# EasyEDA Pro project ProPrj_4足轮足机器蜘蛛_2024-09-02.epro, board 驱动板
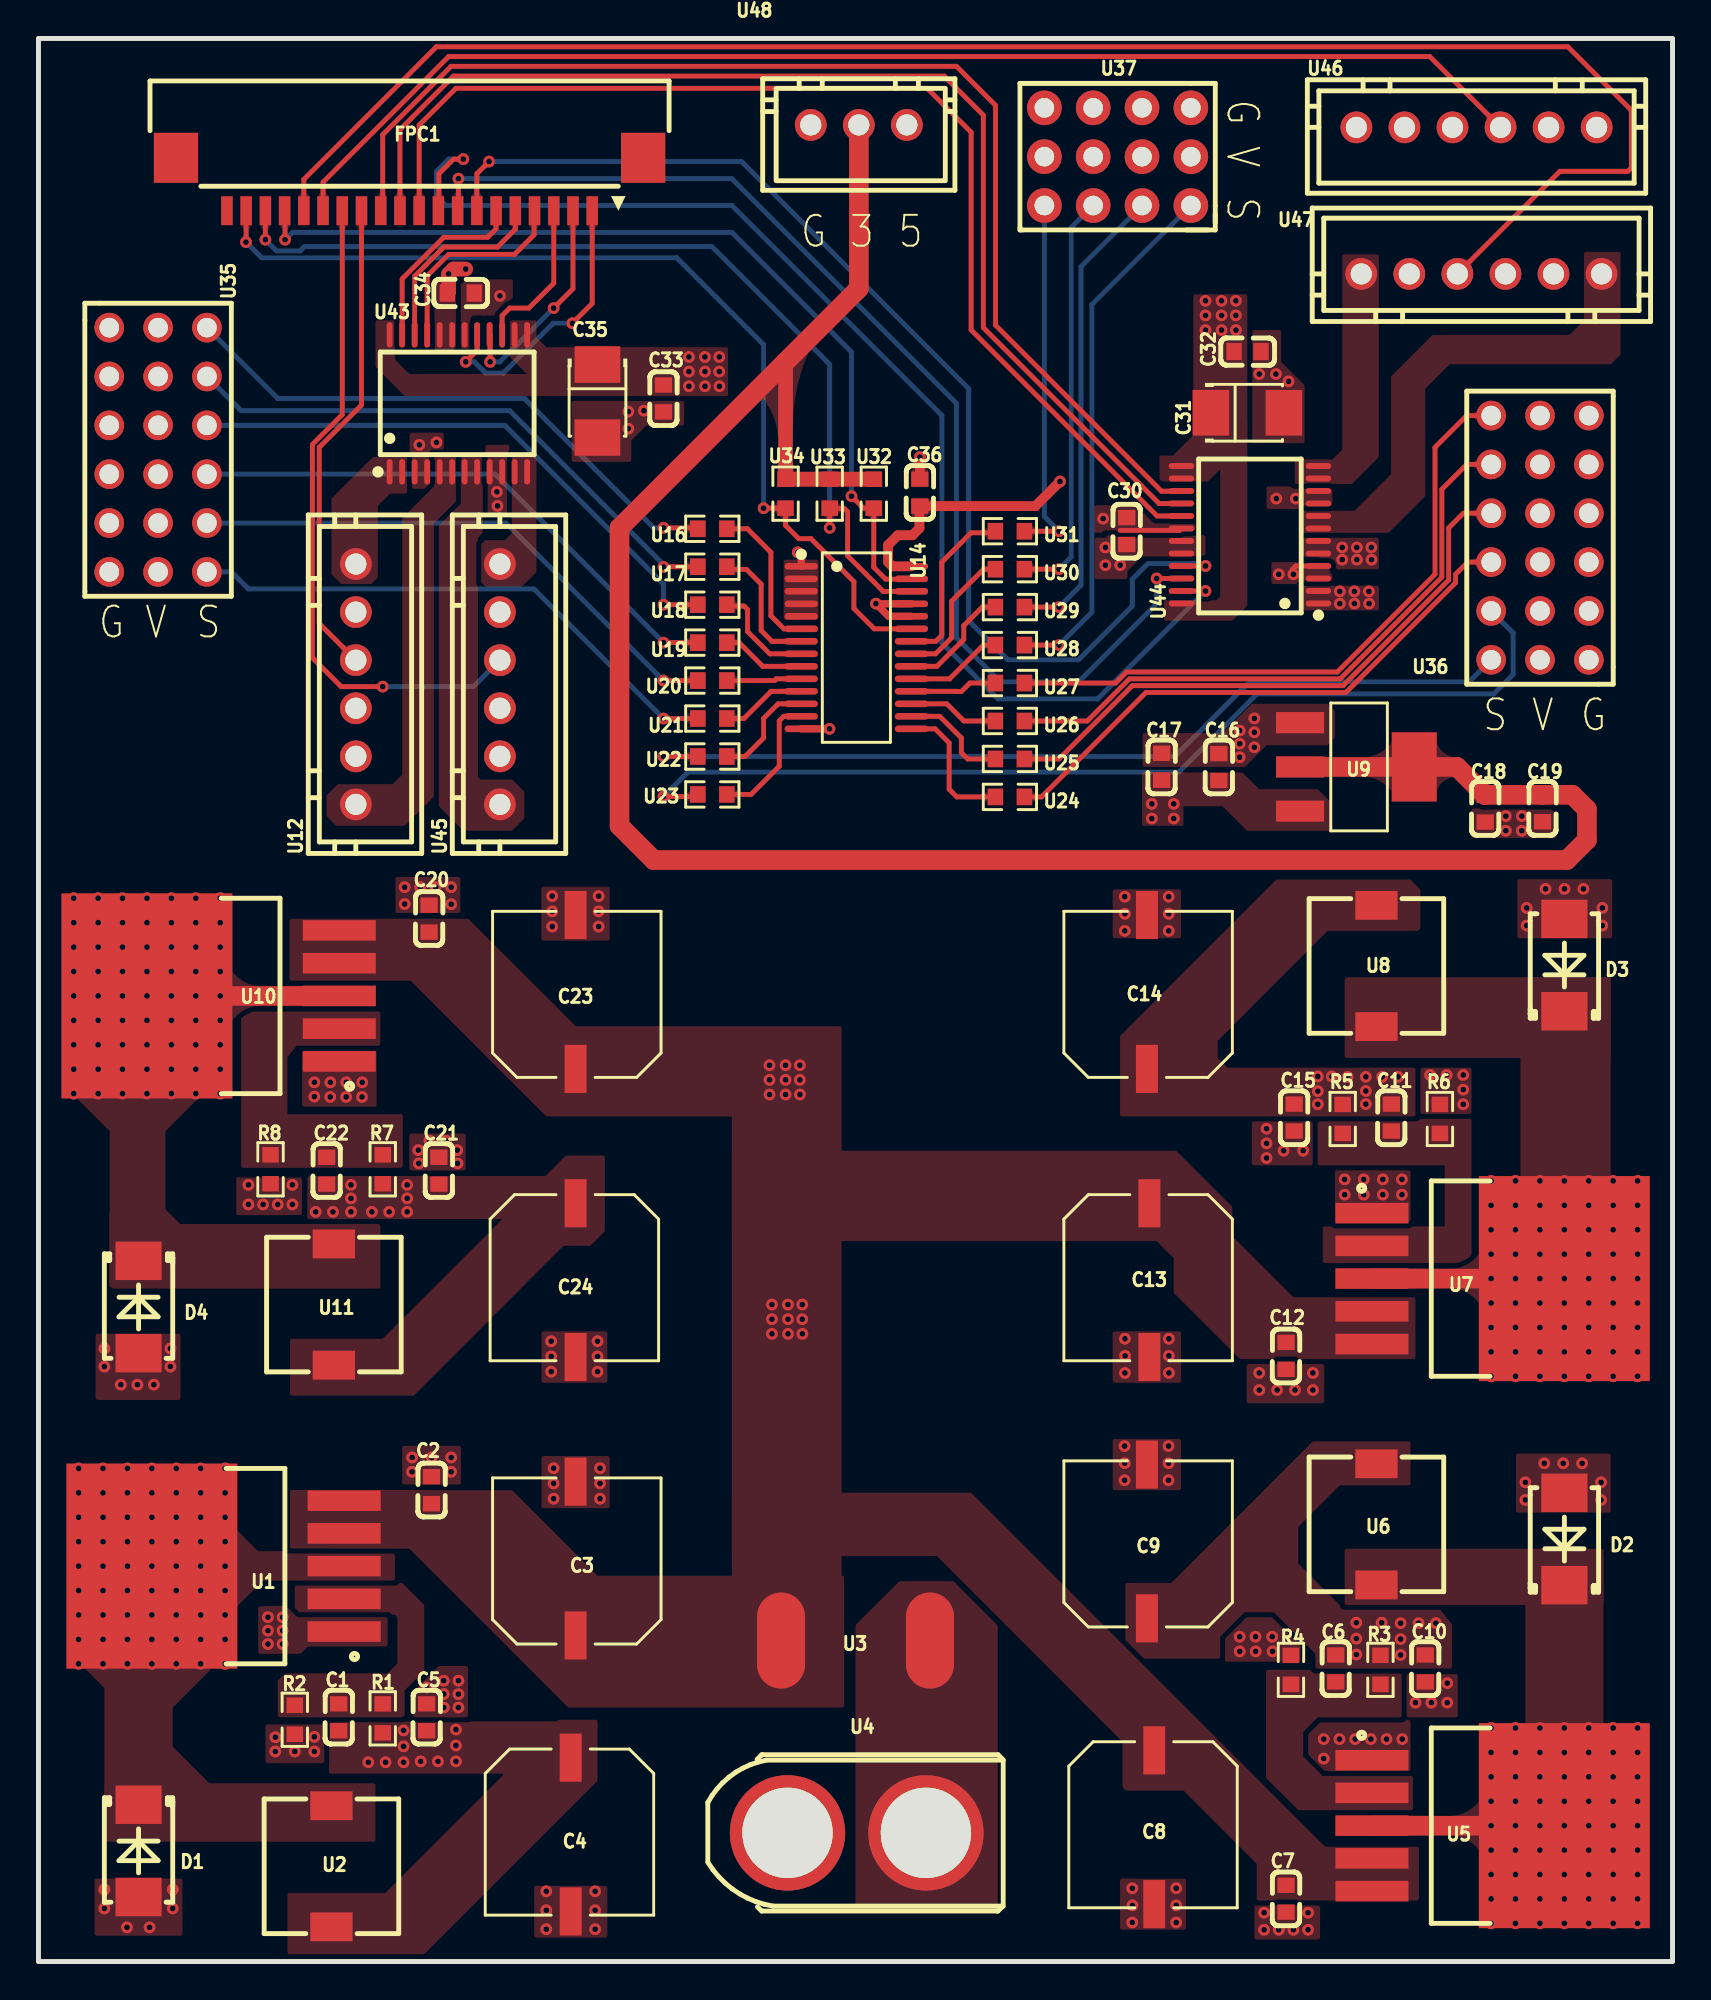
[diagram p2: board, top side]
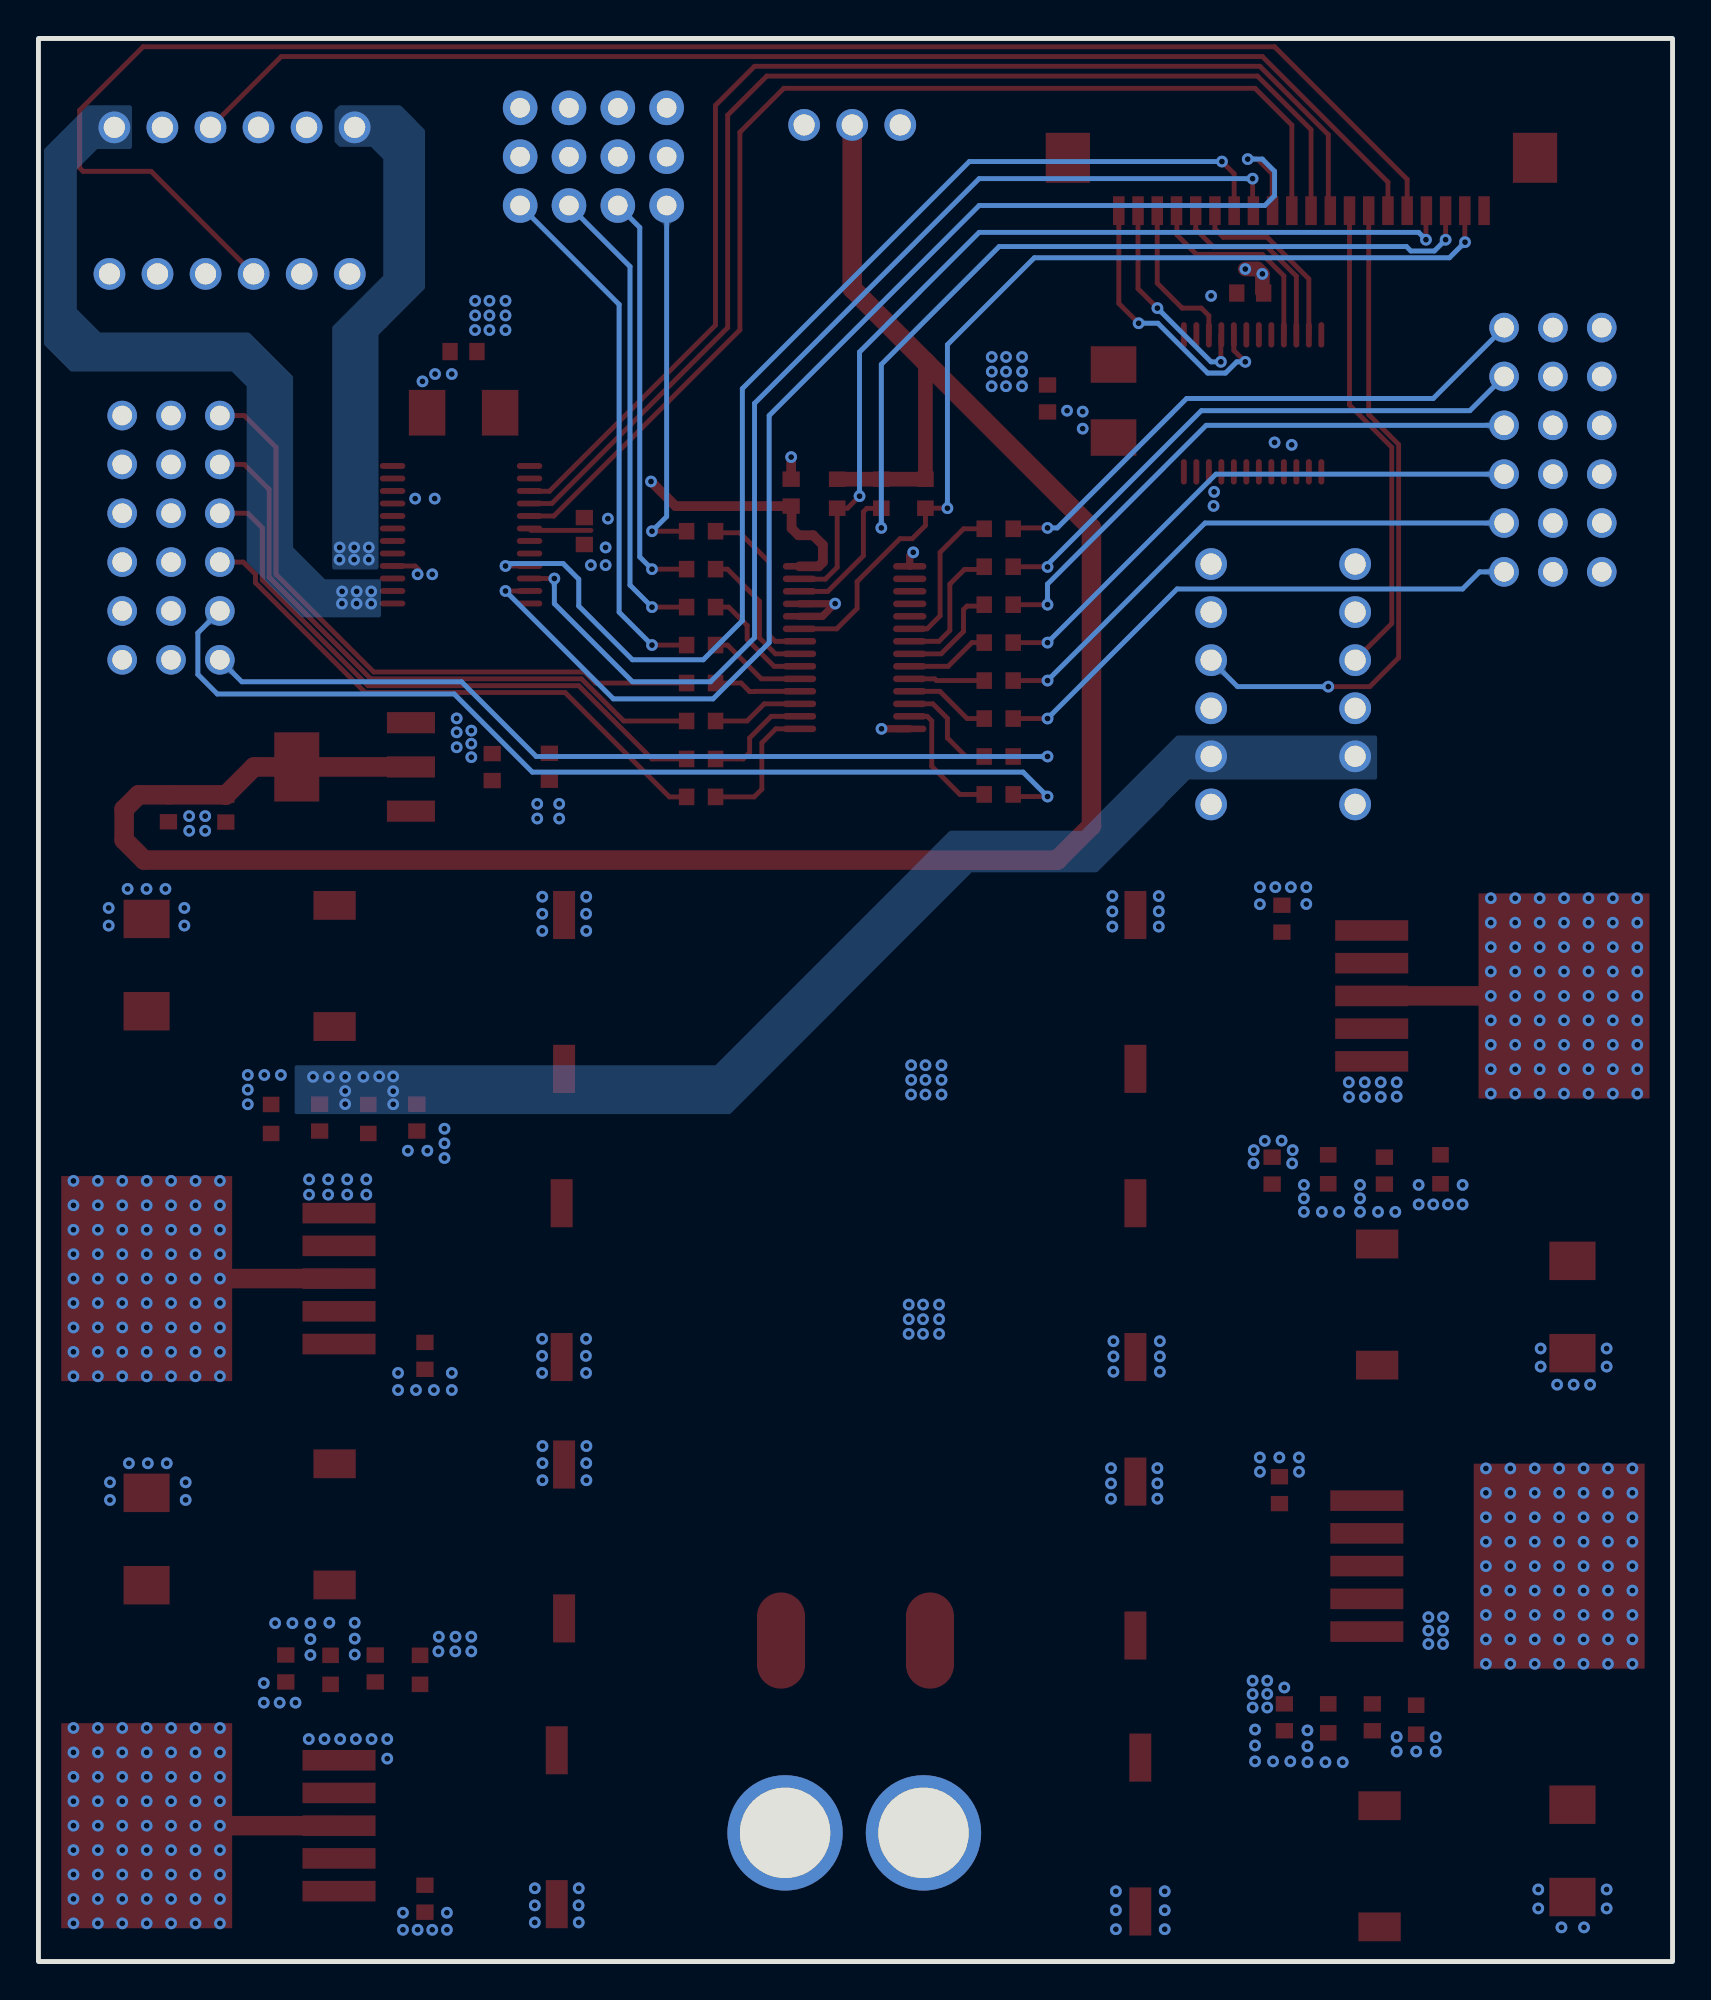
[diagram p3: board, bottom side, seen from below]

Outline 85 x 100 mm; copper layers: Top Layer, GND, VCC, Bottom Layer. Coordinates in mm from the lower left corner of the outline.
Outline path: rectangle 0,100 85,0
Stack: Top Layer 0.035mm 外层铜厚1oz / Dielectric1 0.2104mm 7628 RC49% 8.6mil / GND 0.0152mm 内层铜厚 / Dielectric2 1.065mm 1.1mm H/HOZ Copper / VCC 0.0152mm 内层铜厚 / Dielectric3 0.2104mm 7628 RC49% 8.6mil / Bottom Layer 0.035mm 外层铜厚1oz

## Design rules (mm)
template: 自定义配置
spacing copperThickness1oz (default): track to track 0.102, other pairs 0.152 to 0.3
spacing copperThickness2oz: track to track 0.203, other pairs 0.152 to 0.3
track width copperThickness1oz (default): min 0.127, default 0.254, max 12.7
track width copperThickness2oz: min 0.203, default 0.254, max 2.54
differential pair differentialPair (default): width min 0.127, default 0.254, max 2.54; gap min 0.152, default 0.152
via viaSize (default): diameter min 0.5, default 0.61, max 10; hole min 0.3, default 0.305, max 6.299

## Placement (name value [footprint] x y rotation side)
C1  33nF  [C0603]  15.62 12.7 270 top
C2  1uF  [C0603]  20.45 24.51 270 top
C3  贴片型铝电解电容  [SMD,8X10.5MM]  27.94 20.96 90 top
C4  贴片型铝电解电容  [SMD,8X10.5MM]  27.69 6.6 270 top
C5  1uF  [C0603]  20.19 12.7 270 top
C6  33nF  [C0603]  67.48 15.24 90 top
C7  1uF  [C0603]  64.9 3.27 90 top
C8  贴片型铝电解电容  [SMD,8X10.5MM]  58.04 6.99 270 top
C9  贴片型铝电解电容  [SMD,8X10.5MM]  57.66 21.84 90 top
C10  1uF  [C0603]  72.14 15.24 90 top
C11  33nF  [C0603]  70.37 43.89 90 top
C12  1uF  [C0603]  64.9 31.5 90 top
C13  贴片型铝电解电容  [SMD,8X10.5MM]  57.78 35.43 270 top
C14  贴片型铝电解电容  [SMD,8X10.5MM]  57.66 50.42 90 top
C15  1uF  [C0603]  65.32 43.89 90 top
C16  10uF  [C0603]  61.4 62.11 270 top
C17  100nF  [C0603]  58.43 62.13 90 top
C18  100nF  [C0603]  75.25 59.95 270 top
C19  10uF  [C0603]  78.24 59.97 90 top
C20  1uF  [C0603]  20.32 54.23 270 top
C21  1uF  [C0603]  20.83 41.13 270 top
C22  33nF  [C0603]  14.99 41.13 270 top
C23  贴片型铝电解电容  [SMD,8X10.5MM]  27.94 50.42 90 top
C24  贴片型铝电解电容  [SMD,8X10.5MM]  27.94 35.43 270 top
C30  100nF  [C0603]  56.61 74.39 90 top
C31  10uF  [CAP-SMD_L3.5-W2.8-R-RD]  62.88 80.54 180 top
C32  100nF  [C0603]  62.89 83.72 180 top
C33  100nF  [C0603]  32.51 81.28 90 top
C34  100nF  [C0603]  21.97 86.76 0 top
C35  10uF  [CAP-SMD_L3.5-W2.8-R-RD]  29.08 81.15 90 top
C36  100nF  [C0603]  45.85 76.38 270 top
D1  SS1045-SMB  [SMB_L4.4-W3.6-LS5.3-RD]  5.21 5.75 270 top
D2  SS1045-SMB  [SMB_L4.4-W3.6-LS5.3-RD]  79.38 21.97 90 top
D3  SS1045-SMB  [SMB_L4.4-W3.6-LS5.3-RD]  79.38 51.82 90 top
D4  SS1045-SMB  [SMB_L4.4-W3.6-LS5.3-RD]  5.21 34.04 270 top
FPC1  1.0K-FX-20PWBG  [FPC-SMD_20P-P1.00-HDGE_1.0K-FX-20PWBG]  19.3 92.42 180 top
R1  21kΩ  [R0603]  17.91 12.64 270 top
R2  3kΩ  [R0603]  13.33 12.57 90 top
R3  21kΩ  [R0603]  69.81 15.17 90 top
R4  3kΩ  [R0603]  65.15 15.17 270 top
R5  16kΩ  [R0603]  67.84 43.81 90 top
R6  3kΩ  [R0603]  72.9 43.81 270 top
R7  21kΩ  [R0603]  17.91 41.2 270 top
R8  3kΩ  [R0603]  12.07 41.2 90 top
U1  XL4005E1  [TO-263-5_L10.2-W9.2-P1.70-TL]  10.9 20.56 180 top
U2  33uH/5A  [IND-SMD_L7.0-W7.0_SLF7055T]  15.24 4.95 90 top
U3  船型开关接口  [两个焊盘]  38.63 16.69 270 top
U4  XT60UPB-F  [CONN-TH_XT60UPB-F]  42.56 6.69 0 top
U5  XL4005E1  [TO-263-5_L10.2-W9.2-P1.70-TL]  74.37 7.06 0 top
U6  33uH/5A  [IND-SMD_L7.0-W7.0_SLF7055T]  69.6 22.73 270 top
U7  XL4005E1  [TO-263-5_L10.2-W9.2-P1.70-TL]  74.37 35.51 0 top
U8  33uH/5A  [IND-SMD_L7.0-W7.0_SLF7055T]  69.6 51.77 270 top
U9  AMS1117-3.3  [SOT-223-3_L6.5-W3.4-P2.30-LS7.0-BR]  68.59 62.12 180 top
U10  XL4005E1  [TO-263-5_L10.2-W9.2-P1.70-TL]  10.65 50.21 180 top
U11  33uH/5A  [IND-SMD_L7.0-W7.0_SLF7055T]  15.37 34.16 90 top
U12  XH2.54-6P  [CONN-TH_XH2.54-6P]  16.51 66.42 90 top
U14  PCA9685PW  [TSSOP-28_L9.7-W4.4-P0.65-LS6.4-BL]  42.54 68.33 270 top
U16  220Ω  [R0603]  35.05 74.5 0 top
U17  220Ω  [R0603]  35.05 72.53 0 top
U18  220Ω  [R0603]  35.05 70.56 0 top
U19  220Ω  [R0603]  35.05 68.58 0 top
U20  220Ω  [R0603]  35.05 66.61 0 top
U21  220Ω  [R0603]  35.05 64.64 0 top
U22  220Ω  [R0603]  35.05 62.66 0 top
U23  220Ω  [R0603]  35.05 60.69 0 top
U24  220Ω  [R0603]  50.53 60.56 0 top
U25  220Ω  [R0603]  50.53 62.53 0 top
U26  220Ω  [R0603]  50.53 64.51 0 top
U27  220Ω  [R0603]  50.53 66.48 0 top
U28  220Ω  [R0603]  50.53 68.46 0 top
U29  220Ω  [R0603]  50.53 70.43 0 top
U30  220Ω  [R0603]  50.53 72.4 0 top
U31  220Ω  [R0603]  50.53 74.38 0 top
U32  4.7kΩ  [R0603]  43.45 76.33 90 top
U33  4.7kΩ  [R0603]  41.16 76.33 90 top
U34  4.7kΩ  [R0603]  38.86 76.33 90 top
U35  -  [HX2.54MM-3X6PIN]  3.68 84.96 270 top
U36  -  [HX2.54MM-3X6PIN]  80.65 67.69 90 top
U37  -  [XH2.54MM-3X4P]  59.94 96.39 180 top
U43  TB6612FNG,C,8,EL  [SSOP-24_L8.3-W5.6-P0.65-LS7.6-BL]  21.84 81.03 0 top
U44  TB6612FNG,C,8,EL  [SSOP-24_L8.3-W5.6-P0.65-LS7.6-BL]  63.02 74.19 90 top
U45  XH2.54-6P  [CONN-TH_XH2.54-6P]  24 66.42 90 top
U46  XH2.54-6P  [CONN-TH_XH2.54-6P]  74.8 95.38 0 top
U47  XH2.54-6P  [CONN-TH_XH2.54-6P]  75.06 87.76 180 top
U48  XH2.54-3P 直插  [CONN-TH_XH2.54-3P]  42.67 95.5 0 top

## Footprints (pads in the part's own frame, mm; a bottom-side part is the same pattern mirrored in y, then rotated)
C0603
  rect 0.8x0.9 smd: 1(-0.7,0) 2(0.7,0)
CAP-SMD_L3.5-W2.8-R-RD
  rect 1.9x2.376 smd: 1(1.899,0) 2(-1.899,0)
CONN-TH_XH2.54-3P
  round 1.65 hole 1.1: 1(-2.5,0) 2(0,0) 3(2.5,0)
CONN-TH_XH2.54-6P
  round 1.65 hole 1.1: 1(-6.25,0) 2(-3.75,0) 3(-1.25,0) 4(1.25,0) 5(3.75,0) 6(6.25,0)
CONN-TH_XT60UPB-F
  round 6 hole 4.7: 1(3.6,0) 2(-3.6,0)
FPC-SMD_20P-P1.00-HDGE_1.0K-FX-20PWBG
  rect 0.6x1.5 smd: 1(-9.5,1.375) 2(-8.5,1.375) 3(-7.5,1.375) 4(-6.5,1.375) 5(-5.5,1.375) 6(-4.5,1.375) 7(-3.5,1.375) 8(-2.5,1.375) 9(-1.5,1.375) 10(-0.5,1.375) 11(0.5,1.375) 12(1.5,1.375) 13(2.5,1.375) 14(3.5,1.375) 15(4.5,1.375) 16(5.5,1.375) 17(6.5,1.375) 18(7.5,1.375) 19(8.5,1.375) 20(9.5,1.375)
  rect 2.3x2.6 smd: 21(12.15,-1.375) 22(-12.15,-1.375)
HX2.54MM-3X6PIN
  round 1.54 hole 1.02: 1(0,0) 2(2.54,0) 3(5.08,0) 4(7.62,0) 5(10.16,0) 6(12.7,0) 7(0,2.54) 8(2.54,2.54) 9(5.08,2.54) 10(7.62,2.54) 11(10.16,2.54) 12(12.7,2.54) 13(0,5.08) 14(2.54,5.08) 15(5.08,5.08) 16(7.62,5.08) 17(10.16,5.08) 18(12.7,5.08)
IND-SMD_L7.0-W7.0_SLF7055T
  rect 1.5x2.2 smd: 1(-3.15,0) 2(3.15,0)
R0603
  rect 0.806x0.864 smd: 1(-0.753,0) 2(0.753,0)
SMB_L4.4-W3.6-LS5.3-RD
  rect 2x2.4 smd: 1(-2.4,0) 2(2.4,0)
SMD,8X10.5MM
  rect 2.5x1.143 smd: 1(-4,0) 2(4,0)
SOT-223-3_L6.5-W3.4-P2.30-LS7.0-BR
  rect 2.5x1.1 smd: 1(2.97,-2.3) 2(2.97,0) 3(2.97,2.3)
  rect 2.34x3.6 smd: 4(-2.97,0)
SSOP-24_L8.3-W5.6-P0.65-LS7.6-BL
  oval 0.308x1.324 smd: 1(-3.575,-3.562) 2(-2.925,-3.562) 3(-2.275,-3.562) 4(-1.625,-3.562) 5(-0.975,-3.562) 6(-0.325,-3.562) 7(0.325,-3.562) 8(0.975,-3.562) 9(1.625,-3.562) 10(2.275,-3.562) 11(2.925,-3.562) 12(3.575,-3.562) 13(3.575,3.562) 14(2.925,3.562) 15(2.275,3.562) 16(1.625,3.562) 17(0.975,3.562) 18(0.325,3.562) 19(-0.325,3.562) 20(-0.975,3.562) 21(-1.625,3.562) 22(-2.275,3.562) 23(-2.925,3.562) 24(-3.575,3.562)
TO-263-5_L10.2-W9.2-P1.70-TL
  rect 3.8x1.069 smd: 1(-5.003,3.404) 2(-5.003,1.702) 3(-5.003,0) 4(-5.003,-1.702) 5(-5.003,-3.404)
  rect 8.89x10.66 smd: 6(5.003,0)
TSSOP-28_L9.7-W4.4-P0.65-LS6.4-BL
  oval 0.343x1.732 smd: 1(-4.225,-2.866) 2(-3.575,-2.866) 3(-2.925,-2.866) 4(-2.275,-2.866) 5(-1.625,-2.866) 6(-0.975,-2.866) 7(-0.325,-2.866) 8(0.325,-2.866) 9(0.975,-2.866) 10(1.625,-2.866) 11(2.275,-2.866) 12(2.925,-2.866) 13(3.575,-2.866) 14(4.225,-2.866) 15(4.225,2.866) 16(3.575,2.866) 17(2.925,2.866) 18(2.275,2.866) 19(1.625,2.866) 20(0.975,2.866) 21(0.325,2.866) 22(-0.325,2.866) 23(-0.975,2.866) 24(-1.625,2.866) 25(-2.275,2.866) 26(-2.925,2.866) 27(-3.575,2.866) 28(-4.225,2.866)
XH2.54MM-3X4P
  round 1.8 hole 1.02: 1(0,0) 2(2.54,0) 3(5.08,0) 4(7.62,0) 5(0,2.54) 6(2.54,2.54) 7(5.08,2.54) 8(7.62,2.54) 9(0,5.08) 10(2.54,5.08) 11(5.08,5.08) 12(7.62,5.08)
两个焊盘
  custom 4.999x2.5 smd: 1(0,7.747) 2(0,0)

## Nets
As in the schematic.

Pads without a net: FPC1 20 21 22; U12 3; U45 3; U46 3; U47 3

## Via types
v1: diameter 0.61, hole 0.305, Top Layer to Bottom Layer, 579 vias

## Routing (per net, layer and track width the routed paths; a pad name or vN(x,y) marks a point on that pad's centre or on a via; arc(x,y) is an arc through that point)
3.3V: length 121.2
  Top Layer w0.762: 38.86,83.19 U34.2 U33.2 U32.2
  Top Layer w1.016: U48.2 42.67,87 30.23,74.55 30.23,59.06 32,57.28 79.5,57.28 80.54,58.32 80.54,59.92 79.79,60.67 C19.2 75.27,60.67 C18.1 73.79,62.12 U9.4 U9.2
5V: length 15.2
  Top Layer w0.508: v1(53.14,76.96) 51.86,75.68 C36.2 45.82,75.66 45.82,74.53 45.47,74.17 44.7,74.17 44.2,73.66 44.2,72.77 44.42,72.55 45.41,72.55
  Top Layer w0.762: v1(22.22,88.01) 21.59,88.01 v1(21.34,87.76) 21.34,86.83 C34.1
  vias: v1(55.5,73.53) v1(55.5,72.61) v1(56.27,72.61) v1(57.91,60.2) v1(57.91,59.44) v1(59.06,60.2) v1(59.05,59.44) v1(66.55,46.02) v1(66.55,45.26) v1(66.55,44.58) v1(67.28,46.02) v1(68.1,46) v1(69.04,46) v1(69.04,45.27) v1(69.04,44.59) v1(69.9,46) v1(70.72,46)
6V:
  vias: v1(14.42,38.98) v1(15.32,38.98) v1(16.26,40.39) v1(16.26,39.68) v1(16.26,38.98) v1(17.34,38.98) v1(18.24,38.98) v1(19.18,40.39) v1(19.18,39.68) v1(19.18,38.98)
6V_LEFT:
  vias: v1(17.16,10.36) v1(18.06,10.36) v1(18.99,12.02) v1(18.99,11.19) v1(18.99,10.36) v1(19.88,10.41) v1(20.78,10.41) v1(21.72,12.06) v1(21.72,11.24) v1(21.72,10.41)
6V_RIGHT:
  vias: v1(68.55,17.62) v1(68.55,16.79) v1(68.55,15.96) v1(69.87,17.62) v1(70.85,17.6) v1(70.85,16.77) v1(70.85,15.94) v1(71.79,17.6) v1(72.69,17.6)
11.1V:
  vias: v1(33.84,83.44) v1(33.84,82.68) v1(33.84,81.92) v1(34.67,83.44) v1(34.67,82.68) v1(34.67,81.92) v1(35.41,83.44) v1(35.41,82.68) v1(35.42,81.92) v1(38.03,46.61) v1(38.03,45.85) v1(38.03,45.08) v1(38.15,34.16) v1(38.15,33.4) v1(38.15,32.64) v1(38.86,46.61) v1(38.86,45.85) v1(38.86,45.08) v1(38.99,34.16) v1(38.99,33.4) v1(38.99,32.64) v1(39.6,46.61) v1(39.6,45.85) v1(39.61,45.08) v1(39.73,34.16) v1(39.73,33.4) v1(39.74,32.64) v1(60.71,86.36) v1(60.71,85.6) v1(60.71,84.84) v1(61.54,86.36) v1(61.54,85.6) v1(61.54,84.84) v1(62.28,86.36) v1(62.28,85.6) v1(62.29,84.84)
GND: length 12.3
  Top Layer w0.254: U44.4 65.41,72.57 65.23,72.39 65.23,72.13 65.25,72.11 ; 56.26,74.42 59.36,74.42 U44.18
  Top Layer w0.381: U14.25 43.57,70.6 ; 43.57,70.6 44.22,69.95 U14.24 ; 43.57,70.6 v1(43.56,70.61) ; 39.68,64.1 v1(41.15,64.1) ; v1(39.5,73.28) 39.68,73.1 39.68,72.55
  Top Layer w0.508: 45.85,77.08 v1(45.85,78.23)
  vias: v1(3.43,31.88) v1(3.43,30.94) v1(3.43,3.75) v1(3.43,2.76) v1(4.29,30) v1(4.6,1.78) v1(5.15,30) v1(5.78,1.78) v1(6,30) v1(6.86,31.88) v1(6.86,30.94) v1(6.98,3.75) v1(6.98,2.76) v1(10.92,40.39) v1(10.92,39.37) v1(11.68,39.37) v1(11.94,17.91) v1(11.94,17.21) v1(11.94,16.51) v1(12.32,11.67) v1(12.32,10.92) v1(12.45,39.37) v1(12.7,17.91) v1(12.7,17.21) v1(12.7,16.51) v1(13.21,40.39) v1(13.21,39.37) v1(13.33,10.92) v1(14.35,45.72) v1(14.35,44.98) v1(14.35,11.68) v1(14.35,10.92) v1(15.18,45.72) v1(15.18,44.96) v1(16.01,45.72) v1(16,44.96) v1(16.84,45.72) v1(16.83,44.96) v1(19.05,55.87) v1(19.05,54.99) v1(19.44,26.21) v1(19.43,25.47) v1(19.81,78.87) v1(19.76,42.19) v1(19.79,41.5) v1(19.86,55.87) v1(20.2,14.25) v1(20.34,42.69) v1(20.45,26.21) v1(20.7,78.99) v1(20.66,55.87) v1(21.08,14.6) v1(21.08,13.91) v1(21.08,13.21) v1(21.21,42.68) v1(21.47,55.87) v1(21.47,54.98) v1(21.47,26.21) v1(21.46,25.47) v1(21.78,42.19) v1(21.8,41.5) v1(21.84,14.6) v1(21.84,13.91) v1(21.84,13.21) v1(23.85,76.42) v1(23.88,75.69) v1(24,86.61) v1(26.42,3.65) v1(26.42,2.67) v1(26.42,1.68) v1(26.73,55.4) v1(26.73,54.61) v1(26.73,53.82) v1(26.67,32.26) v1(26.67,31.47) v1(26.67,30.67) v1(26.8,25.65) v1(26.8,24.86) v1(26.8,24.07) v1(28.96,3.65) v1(28.96,2.67) v1(28.96,1.68) v1(29.14,55.4) v1(29.14,54.61) v1(29.14,53.82) v1(29.08,32.26) v1(29.08,31.47) v1(29.08,30.67) v1(29.21,25.65) v1(29.21,24.86) v1(29.21,24.07) v1(30.68,80.6) v1(30.68,79.71) v1(31.5,80.64) v1(55.38,75.03) v1(56.51,55.37) v1(56.51,54.48) v1(56.51,53.59) v1(56.51,32.39) v1(56.52,31.5) v1(56.51,30.61) v1(56.5,26.81) v1(56.51,25.92) v1(56.5,25.03) v1(56.9,3.81) v1(56.91,2.92) v1(56.9,2.03) v1(58.79,55.37) v1(58.79,54.48) v1(58.79,53.59) v1(58.8,32.39) v1(58.8,31.5) v1(58.8,30.61) v1(58.78,26.81) v1(58.78,25.92) v1(58.78,25.03) v1(59.18,3.81) v1(59.18,2.92) v1(59.18,2.03) v1(62.48,64.01) v1(62.48,63.33) v1(62.48,62.63) v1(62.48,16.89) v1(62.48,16.13) v1(63.25,64.64) v1(63.25,63.92) v1(63.25,63.14) v1(63.31,16.89) v1(63.32,16.13) v1(63.5,82.55) v1(63.5,30.61) v1(63.5,29.72) v1(63.75,2.54) v1(63.75,1.65) v1(63.88,43.31) v1(63.88,42.55) v1(63.88,41.78) v1(64.18,16.89) v1(64.19,16.13) v1(64.37,82.55) v1(64.39,76.07) v1(64.43,29.72) v1(64.52,72.14) v1(64.52,1.65) v1(64.77,42.16) v1(65.02,82.17) v1(65.28,72.14) v1(65.28,1.65) v1(65.41,76.07) v1(65.36,29.72) v1(65.79,42.16) v1(66.04,2.54) v1(66.04,1.65) v1(66.29,30.61) v1(66.29,29.72) v1(66.86,11.57) v1(66.86,10.55) v1(67.67,11.57) v1(67.94,40.67) v1(67.94,39.88) v1(68.49,11.57) v1(68.94,40.67) v1(68.94,39.88) v1(69.31,11.57) v1(69.93,40.67) v1(69.93,39.88) v1(70.12,11.57) v1(70.92,40.67) v1(70.92,39.88) v1(70.94,11.57) v1(71.63,13.46) v1(72.39,46.1) v1(72.45,13.46) v1(73.25,46.1) v1(73.28,14.48) v1(73.28,13.46) v1(74.11,46.1) v1(74.11,45.34) v1(74.11,44.58) v1(76.33,59.56) v1(76.33,58.8) v1(77.16,59.56) v1(77.16,58.8) v1(77.34,24.92) v1(77.34,24) v1(77.41,54.79) v1(77.41,53.87) v1(78.33,25.91) v1(78.39,55.78) v1(79.31,25.91) v1(79.38,55.78) v1(80.3,25.91) v1(80.36,55.78) v1(81.35,54.79) v1(81.35,53.87) v1(81.28,24.92) v1(81.28,24)
I2C1_SCL: length 50.6
  Top Layer w0.254: 45.41,71.25 45.41,71.25 43.94,71.25 42.09,73.1 42.09,75.39 41.91,75.56 41.17,75.56 U33.1 v1(41.16,74.55) ; FPC1.18 v1(11.8,89.53)
  Bottom Layer w0.254: v1(11.8,89.53) 12.39,88.95 13.61,88.95 13.84,89.18 35.03,89.18 41.16,83.05 v1(41.16,74.55)
I2C1_SDA: length 47.9
  Top Layer w0.254: v1(12.83,89.53) 12.83,91.02 FPC1.17 ; v1(42.29,76.2) 42.92,75.57 U32.1 43.45,72.5 44.07,71.88 45.39,71.88 U14.27
  Bottom Layer w0.254: v1(12.83,89.53) 13.21,89.92 36.07,89.92 42.29,83.69 v1(42.29,76.2)
LEFT1_AIN1: length 10.8
  Top Layer w0.254: U43.21 20.22,87.66 21.34,88.77 24.76,88.77 25.78,89.79 25.78,91.02 FPC1.4
LEFT1_AIN2: length 10.3
  Top Layer w0.254: U43.22 19.57,87.64 21.08,89.15 23.88,89.15 24.8,90.08 FPC1.5
LEFT1_IN: length 25.1
  Top Layer w0.254: U12.4 14.61,69.58 14.61,78.74 16.8,80.94 FPC1.13
LEFT1_PWM: length 9.8
  Top Layer w0.254: FPC1.6 23.8,90.1 23.37,89.66 21.08,89.66 18.92,87.5 18.92,84.59
LEFT2_BIN1: length 14.8
  Top Layer w0.254: FPC1.1 28.8,86.22 v1(27.77,85.19) ; v1(22.22,83.19) 22.82,83.78 U43.17
  Bottom Layer w0.254: v1(27.77,85.19) 26.77,85.19 24.18,82.6 23.25,82.6 22.67,83.19 v1(22.22,83.19)
LEFT2_BIN2: length 11.4
  Top Layer w0.254: U43.16 23.5,84.56 v1(23.5,83.19) ; v1(26.8,85.98) 27.8,86.99 FPC1.2
  Bottom Layer w0.254: v1(26.8,85.98) 24,83.19 v1(23.5,83.19)
LEFT2_IN: length 34.8
  Top Layer w0.254: FPC1.14 15.8,80.44 14.25,78.89 14.25,67.79 15.75,66.29 v1(17.91,66.29)
  Bottom Layer w0.254: U45.4 22.63,66.29 v1(17.91,66.29)
LEFT2_PWM: length 8.2
  Top Layer w0.254: FPC1.3 26.8,87.27 25.51,85.98 24.51,85.98 24.12,85.59 U43.15
PAC9685_OE: length 50.9
  Top Layer w0.254: FPC1.19 10.8,89.42 v1(10.8,89.41) ; v1(37.72,75.57) U34.1 38.86,74.68 39.55,73.99 40.18,73.99 42.42,71.75 42.42,70.36 43.47,69.3 U14.23
  Bottom Layer w0.254: v1(37.72,75.57) 37.72,84.07 33.2,88.59 11.61,88.59 v1(10.8,89.41)
PWM0: length 29.9
  Top Layer w0.254: U16.1 34.25,74.55 v1(32.51,74.55)
  Bottom Layer w0.254: U35.13 12.45,81.28 25.27,81.28 32,74.55 v1(32.51,74.55)
PWM1: length 29.7
  Top Layer w0.254: U17.1 32.53,72.53 v1(32.51,72.52)
  Bottom Layer w0.254: v1(32.51,72.52) 32.51,72.64 24.51,80.64 10.54,80.64 8.76,82.42
PWM2: length 30
  Top Layer w0.254: U18.1 v1(32.51,70.56)
  Bottom Layer w0.254: v1(32.51,70.56) 32.51,71.63 24.26,79.88 U35.15
PWM3: length 29.2
  Top Layer w0.254: U19.1 v1(32.51,68.58)
  Bottom Layer w0.254: 8.76,77.34 23.75,77.34 v1(32.51,68.58)
PWM4: length 28.9
  Top Layer w0.254: U20.1 v1(32.51,66.61)
  Bottom Layer w0.254: v1(32.51,66.61) 24.32,74.8 U35.17
PWM5: length 28.7
  Top Layer w0.254: U21.1 v1(32.51,64.64)
  Bottom Layer w0.254: v1(32.51,64.64) 25.77,71.37 10.92,71.37 10.03,72.26 8.76,72.26
PWM6: length 46.9
  Top Layer w0.254: U22.1 v1(32.51,62.66)
  Bottom Layer w0.254: U36.13 74.42,66.55 62.99,66.55 59.11,62.66 v1(32.51,62.66)
PWM7: length 52.4
  Top Layer w0.254: v1(32.51,60.58) 34.19,60.58 U23.1
  Bottom Layer w0.254: v1(32.51,60.58) 33.78,61.85 59.31,61.85 63.37,65.91 75.69,65.91 76.71,66.93 76.71,69.09 U36.14
PWM8: length 29.6
  Top Layer w0.254: U36.15 74.35,72.77 73.71,72.14 73.71,71.69 68.01,65.99 57.61,65.99 52.18,60.56 U24.2
PWM9: length 31.2
  Top Layer w0.254: U25.2 53.09,62.53 56.9,66.34 67.86,66.34 73.35,71.84 73.35,74.55 74.12,75.31 U36.16
PWM10: length 32.5
  Top Layer w0.254: U36.17 74.29,77.85 73,76.56 73,71.99 67.71,66.7 56.75,66.7 54.56,64.51 U26.2
PWM11: length 33.9
  Top Layer w0.254: U27.2 56.03,66.48 56.6,67.06 67.56,67.06 72.64,72.14 72.64,78.74 74.29,80.39 U36.18
PWM12: length 27.5
  Top Layer w0.254: U28.2 v1(53.09,68.46)
  Bottom Layer w0.254: U37.9 54.8,86.16 54.8,70.17 v1(53.09,68.46)
PWM13: length 24.5
  Top Layer w0.254: U29.2 v1(53.09,70.43)
  Bottom Layer w0.254: v1(53.09,70.43) 54.23,71.57 54.23,88.14 U37.10
PWM14: length 21.4
  Top Layer w0.254: U30.2 v1(53.09,72.4)
  Bottom Layer w0.254: U37.11 53.72,90.17 53.72,73.04 v1(53.09,72.4)
PWM15: length 19.1
  Top Layer w0.254: U31.2 v1(53.09,74.38)
  Bottom Layer w0.254: v1(53.09,74.38) 52.32,75.14 U37.12
RIGHT1_AIN1: length 62.1
  Top Layer w0.254: v1(23.44,93.6) 22.8,92.96 FPC1.7 ; U44.21 v1(60.71,72.57)
  Bottom Layer w0.254: v1(23.44,93.6) 36.58,93.6 48.39,81.79 48.39,69.72 50.42,67.69 54.1,67.69 56.9,70.48 56.9,71.88 57.71,72.7 60.58,72.7 v1(60.71,72.57)
RIGHT1_AIN2: length 60.3
  Top Layer w0.254: v1(21.84,92.71) 21.84,91.08 FPC1.8 ; U44.22 v1(58.17,71.92)
  Bottom Layer w0.254: v1(21.84,92.71) 36.07,92.71 47.75,81.03 47.75,68.83 50.04,66.55 54.1,66.55 58.17,70.61 v1(58.17,71.92)
RIGHT1_IN: length 67
  Top Layer w0.254: FPC1.15 14.8,92.53 21.34,99.06 72.37,99.06 U46.4
RIGHT1_PWM: length 67.8
  Top Layer w0.254: U44.23 v1(60.71,71.27) ; v1(22.1,93.73) 21.59,93.73 20.83,92.96 20.83,91.07 FPC1.9
  Bottom Layer w0.254: v1(60.71,71.27) 55.1,65.66 49.91,65.66 46.99,68.58 46.99,80.39 36.07,91.31 21.21,91.31 20.7,91.82 20.7,93.09 21.34,93.73 v1(22.1,93.73)
RIGHT2_BIN1: length 60.1
  Top Layer w0.254: FPC1.10 19.8,95.5 21.72,97.41 46.23,97.41 48.51,95.12 48.51,84.84 58.19,75.17 U44.17
RIGHT2_BIN2: length 61.7
  Top Layer w0.254: FPC1.11 18.8,95.26 21.59,98.04 47.12,98.04 49.15,96.01 49.15,84.96 58.29,75.82 U44.16
RIGHT2_IN: length 89.2
  Top Layer w0.254: U47.4 79.14,93.09 82.68,93.09 82.86,93.27 82.86,96.27 79.55,99.57 20.7,99.57 13.8,92.67 FPC1.16
RIGHT2_PWM: length 62.9
  Top Layer w0.254: FPC1.12 17.91,91.15 17.91,95 21.46,98.55 47.75,98.55 49.78,96.52 49.78,85.09 58.42,76.45 59.44,76.45 U44.15
RIGHT_1_AO1:
  vias: v1(67.69,71.25) v1(67.69,70.61) v1(68.45,71.25) v1(68.45,70.61) v1(69.21,71.25) v1(69.22,70.61)
RIGHT_1_AO2:
  vias: v1(67.82,73.53) v1(67.82,72.9) v1(68.58,73.53) v1(68.58,72.9) v1(69.33,73.53) v1(69.34,72.9)
$2N1309: length 10
  Top Layer w1.016: v1(79.37,35.51) v1(78.1,35.51) v1(76.83,35.51) v1(75.56,35.51) U7.3
  vias: v1(75.56,40.59) v1(75.56,39.32) v1(75.56,38.05) v1(75.56,36.78) v1(75.56,34.24) v1(75.56,32.97) v1(75.56,31.7) v1(75.56,30.43) v1(76.83,40.59) v1(76.83,39.32) v1(76.83,38.05) v1(76.83,36.78) v1(76.83,34.24) v1(76.83,32.97) v1(76.83,31.7) v1(76.83,30.43) v1(78.1,40.59) v1(78.1,39.32) v1(78.1,38.05) v1(78.1,36.78) v1(78.1,34.24) v1(78.1,32.97) v1(78.1,31.7) v1(78.1,30.43) v1(79.37,40.59) v1(79.37,39.32) v1(79.37,38.05) v1(79.37,36.78) v1(79.37,34.24) v1(79.37,32.97) v1(79.37,31.7) v1(79.37,30.43) v1(80.64,40.59) v1(80.64,39.32) v1(80.64,38.05) v1(80.64,36.78) v1(80.64,35.51) v1(80.64,34.24) v1(80.64,32.97) v1(80.64,31.7) v1(80.64,30.43) v1(81.91,40.59) v1(81.91,39.32) v1(81.91,38.05) v1(81.91,36.78) v1(81.91,35.51) v1(81.91,34.24) v1(81.91,32.97) v1(81.91,31.7) v1(81.91,30.43) v1(83.18,40.59) v1(83.18,39.32) v1(83.18,38.05) v1(83.18,36.78) v1(83.18,35.51) v1(83.18,34.24) v1(83.18,32.97) v1(83.18,31.7) v1(83.18,30.43)
$2N1319: length 10
  Top Layer w1.016: v1(79.37,7.06) v1(78.1,7.06) v1(76.83,7.06) v1(75.56,7.06) U5.3
  vias: v1(75.56,12.15) v1(75.56,10.88) v1(75.56,9.6) v1(75.56,8.34) v1(75.56,5.79) v1(75.56,4.53) v1(75.56,3.25) v1(75.56,1.99) v1(76.83,12.15) v1(76.83,10.88) v1(76.83,9.6) v1(76.83,8.34) v1(76.83,5.79) v1(76.83,4.53) v1(76.83,3.25) v1(76.83,1.99) v1(78.1,12.15) v1(78.1,10.88) v1(78.1,9.6) v1(78.1,8.34) v1(78.1,5.79) v1(78.1,4.53) v1(78.1,3.25) v1(78.1,1.99) v1(79.37,12.15) v1(79.37,10.88) v1(79.37,9.6) v1(79.37,8.34) v1(79.37,5.79) v1(79.37,4.53) v1(79.37,3.25) v1(79.37,1.99) v1(80.64,12.15) v1(80.64,10.88) v1(80.64,9.6) v1(80.64,8.34) v1(80.64,7.06) v1(80.64,5.79) v1(80.64,4.53) v1(80.64,3.25) v1(80.64,1.99) v1(81.91,12.15) v1(81.91,10.88) v1(81.91,9.6) v1(81.91,8.34) v1(81.91,7.06) v1(81.91,5.79) v1(81.91,4.53) v1(81.91,3.25) v1(81.91,1.99) v1(83.18,12.15) v1(83.18,10.88) v1(83.18,9.6) v1(83.18,8.34) v1(83.18,7.06) v1(83.18,5.79) v1(83.18,4.53) v1(83.18,3.25) v1(83.18,1.99)
$2N1328:
  vias: v1(2.09,25.64) v1(2.09,24.37) v1(2.09,23.1) v1(2.09,21.83) v1(2.09,20.56) v1(2.09,19.29) v1(2.09,18.02) v1(2.09,16.75) v1(2.09,15.48) v1(3.36,25.64) v1(3.36,24.37) v1(3.36,23.1) v1(3.36,21.83) v1(3.36,20.56) v1(3.36,19.29) v1(3.36,18.02) v1(3.36,16.75) v1(3.36,15.48) v1(4.63,25.64) v1(4.63,24.37) v1(4.63,23.1) v1(4.63,21.83) v1(4.63,20.56) v1(4.63,19.29) v1(4.63,18.02) v1(4.63,16.75) v1(4.63,15.48) v1(5.9,25.64) v1(5.9,24.37) v1(5.9,23.1) v1(5.9,21.83) v1(5.9,20.56) v1(5.9,19.29) v1(5.9,18.02) v1(5.9,16.75) v1(5.9,15.48) v1(7.17,25.64) v1(7.17,24.37) v1(7.17,23.1) v1(7.17,21.83) v1(7.17,20.56) v1(7.17,19.29) v1(7.17,18.02) v1(7.17,16.75) v1(7.17,15.48) v1(8.44,25.64) v1(8.44,24.37) v1(8.44,23.1) v1(8.44,21.83) v1(8.44,20.56) v1(8.44,19.29) v1(8.44,18.02) v1(8.44,16.75) v1(8.44,15.48) v1(9.71,25.64) v1(9.71,24.37) v1(9.71,23.1) v1(9.71,21.83) v1(9.71,20.56) v1(9.71,19.29) v1(9.71,18.02) v1(9.71,16.75) v1(9.71,15.48)
$2N2945: length 10
  Top Layer w1.016: v1(5.64,50.21) v1(6.91,50.21) v1(8.18,50.21) v1(9.45,50.21) U10.3
  vias: v1(1.83,55.29) v1(1.83,54.02) v1(1.83,52.75) v1(1.83,51.48) v1(1.83,50.21) v1(1.83,48.94) v1(1.83,47.67) v1(1.83,46.4) v1(1.83,45.13) v1(3.1,55.29) v1(3.1,54.02) v1(3.1,52.75) v1(3.1,51.48) v1(3.1,50.21) v1(3.1,48.94) v1(3.1,47.67) v1(3.1,46.4) v1(3.1,45.13) v1(4.37,55.29) v1(4.37,54.02) v1(4.37,52.75) v1(4.37,51.48) v1(4.37,50.21) v1(4.37,48.94) v1(4.37,47.67) v1(4.37,46.4) v1(4.37,45.13) v1(5.64,55.29) v1(5.64,54.02) v1(5.64,52.75) v1(5.64,51.48) v1(5.64,48.94) v1(5.64,47.67) v1(5.64,46.4) v1(5.64,45.13) v1(6.91,55.29) v1(6.91,54.02) v1(6.91,52.75) v1(6.91,51.48) v1(6.91,48.94) v1(6.91,47.67) v1(6.91,46.4) v1(6.91,45.13) v1(8.18,55.29) v1(8.18,54.02) v1(8.18,52.75) v1(8.18,51.48) v1(8.18,48.94) v1(8.18,47.67) v1(8.18,46.4) v1(8.18,45.13) v1(9.45,55.29) v1(9.45,54.02) v1(9.45,52.75) v1(9.45,51.48) v1(9.45,48.94) v1(9.45,47.67) v1(9.45,46.4) v1(9.45,45.13)
$2N4931: length 8
  Top Layer w0.254: U16.2 36.88,74.5 38.1,73.28 38.1,69.98 38.78,69.3 39.68,69.3
$2N5771: length 6.9
  Top Layer w0.254: U17.2 35.95,72.39 36.83,72.39 37.59,71.63 37.59,69.22 38.16,68.65 39.68,68.65
$2N5775: length 5.6
  Top Layer w0.254: 39.68,68 38.04,68 36.88,69.16 36.88,70.31 36.7,70.48 35.88,70.48 U18.2
$2N5780: length 4.4
  Top Layer w0.254: U19.2 36.45,68.58 37.68,67.35 39.68,67.35
$2N5785: length 3.9
  Top Layer w0.254: 39.68,66.7 38.38,66.7 38.29,66.61 U20.2
$2N5790: length 4.5
  Top Layer w0.254: U21.2 36.7,64.64 38.11,66.05 39.68,66.05
$2N5795: length 5.6
  Top Layer w0.254: U22.2 36.75,62.66 37.72,63.63 37.72,64.64 38.48,65.4 39.68,65.4
$2N5800: length 6.9
  Top Layer w0.254: 39.68,64.75 38.77,64.75 38.53,64.52 38.53,62.16 37.07,60.69 U23.2
$2N5805: length 9
  Top Layer w0.254: U14.22 46.68,68.65 46.99,68.96 46.99,72.77 48.51,74.3 49.7,74.3 U31.1
$2N5810: length 7.3
  Top Layer w0.254: U30.1 49.16,72.4 47.5,70.74 47.5,68.83 46.66,68 U14.21
$2N5815: length 6.1
  Top Layer w0.254: U14.20 46.74,67.35 48.13,68.75 48.13,69.47 49.09,70.43 U29.1
$2N5820: length 5.1
  Top Layer w0.254: U28.1 49.15,68.46 47.4,66.7 U14.19
$2N5825: length 4.6
  Top Layer w0.254: U27.1 48.45,66.48 48.01,66.04 47.75,66.04 47.74,66.05 45.41,66.05
$2N5830: length 4.7
  Top Layer w0.254: U26.1 48.14,64.51 47.25,65.4 U14.17
$2N5835: length 5.7
  Top Layer w0.254: 45.41,64.75 46.88,64.75 48.01,63.63 48.01,62.86 48.34,62.53 U25.1
$2N5840: length 7.2
  Top Layer w0.254: U14.15 46.64,64.1 47.37,63.37 47.37,60.96 47.77,60.56 U24.1

## Copper pours and planes (outline as drawn; the poured copper is in the pictures)
5V on Top Layer: 59.56,61.85 57.4,61.85 57.4,59.06 59.56,59.06
5V on Top Layer: 21.72,87.38 21.72,83.95 21.59,83.82 20.57,83.82 20.57,87.25 20.7,87.38
5V on Top Layer: 71.63,46.48 71.63,43.94 56.26,43.94 56.26,48.13 64.39,56.26 71.37,56.26 71.88,55.75 71.88,53.72 71.75,53.59 67.06,53.59 61.34,47.88 61.34,46.99 61.85,46.48
5V on Top Layer: 54.94,74.09 54.94,71.88 56.64,71.88 56.64,72.3 57.63,73.29 56.83,74.09
5V on Top Layer: 57.71,61.83 62.63,61.83 63.5,60.96 66.55,60.96 67.18,60.33 67.18,58.79 62.87,58.79 61.59,60.07 57.91,60.07 57.66,60.33 57.66,61.78
5V on Top Layer: 55.55,74.17 55.55,73.07 60.64,73.07 60.71,73.14 60.71,74.17
5V on Bottom Layer: 29.94,56.64 36.45,56.64 49.02,44.07 71.68,44.07 71.68,46.61 49.78,46.61 37.59,58.8 30.73,58.8 25.78,63.75 15.37,63.75 15.37,61.47 25.15,61.47 26.42,60.2 26.42,60.16
5V on VCC: 0.26,99.74 84.74,99.74 84.74,38.93 0.26,38.93
6V on Top Layer: 14.01,40.85 26.92,40.85 26.92,40.13 25.4,38.61 13.98,38.61 13.98,40.82
6V on Top Layer: 13.08,32.39 13.08,29.43 19.52,29.43 27.31,37.21 28.7,37.21 29.46,37.97 29.46,41.91 27.43,41.91 17.91,32.39
6V on VCC: 10.48,95.06 65.47,95.06 65.47,35.37 10.48,35.37
6V_LEFT on Top Layer: 12.95,3.56 12.95,0.38 20.07,0.38 29.08,9.4 29.08,12.57 27.05,12.57 18.03,3.56
6V_LEFT on Top Layer: 15.11,12.45 15.11,9.77 24.14,9.77 24.76,9.14 28.57,9.14 28.96,9.53 28.96,12.49 15.16,12.49
6V_LEFT on VCC: 0.26,87.7 24.17,87.7 24.17,0.26 0.26,0.26
6V_RIGHT on Top Layer: 71.37,27.05 66.29,27.05 58.93,19.69 56.53,19.69 56.53,16.62 57.4,15.75 61.47,15.75 61.47,16.89 62.74,18.16 64.26,18.16 66.42,16 66.42,15.25 66.44,15.23 73.53,15.23 73.53,17.53 72.93,18.29 67.94,18.29 65.53,20.7 65.53,22.61 67.69,24.76 71.37,24.76
6V_RIGHT on VCC: 61.02,83.88 84.39,83.88 84.39,0.57 61.02,0.57
11.1V on Top Layer: 62.88,86.7 62.88,79.01 60.83,76.96 58.31,76.96 58.31,78.31 59.01,78.31 60.07,79.38 60.07,86.7
11.1V on Top Layer: 35.87,81.4 26.55,81.4 24.51,83.44 24.51,85.34 25.91,85.34 25.91,84.45 26.42,83.95 35.87,83.95
11.1V on Top Layer: 36.07,21.08 46.74,21.08 56.39,11.43 56.39,9.07 56.57,8.89 59.56,8.89 63.37,5.08 63.37,3.18 71.81,3.18 71.81,5.92 71.75,5.97 66.93,5.97 48.51,24.38 36.07,24.38
11.1V on Top Layer: 13.08,24.52 13.08,21.48 20.83,21.46 20.83,24.52
11.1V on Top Layer: 36.19,37.47 36.07,37.59 36.07,42.16 59.18,42.16 62.1,39.24 62.1,37.72 65.28,34.54 71.63,34.54 71.63,31.33 62.5,31.33 59.06,34.77 59.06,36.58 58.17,37.47
11.1V on Top Layer: 41.91,20.07 41.91,13.21 27.56,13.21 19.05,21.72 13.13,21.72 13.13,24.44 13.21,24.51 24.64,24.51 29.08,20.07
11.1V on Top Layer: 26.67,81.41 26.67,82.55 19.3,82.55 18.54,83.31 18.54,85.34 17.53,85.34 17.53,82.93 19.05,81.41
11.1V on Top Layer: 41.78,13.46 41.78,48.64 27.94,48.64 22.35,54.23 13.06,54.23 13.06,51 19.35,51 26.42,43.94 36.07,43.94 36.07,13.59 36.19,13.46
11.1V on Top Layer: 62.88,80.13 62.88,70.5 62.1,69.72 58.54,69.72 58.54,70.79 61.26,70.79 61.47,70.99 61.47,79.76 61.85,80.13
11.1V on VCC: 11.87,96.58 43.79,96.58 43.79,43.66 11.87,43.66
11.1V on VCC: 11.87,88.28 72.58,88.28 72.58,0.26 11.87,0.26
GND on Top Layer: 76.86,23.35 76.86,26.42 81.79,26.42 81.79,23.35
GND on Top Layer: 71,14.94 73.83,14.94 73.83,12.7 71.01,12.7 71,12.71
GND on Top Layer: 63.12,43.69 66.38,43.69 66.38,41.45 66.38,41.4 63.12,41.4
GND on Top Layer: 56.26,4.32 59.69,4.32 59.69,1.65 56.26,1.65
GND on Top Layer: 26.16,32.77 29.59,32.77 29.59,30.1 26.18,30.1 26.16,30.12
GND on Top Layer: 12.87,18.5 11.49,18.48 11.43,18.41 11.43,16 13.64,16 14.1,16.46 14.1,17.27
GND on Top Layer: 71.88,44.07 71.88,46.48 74.55,46.48 74.55,44.07 74.54,44.07
GND on Top Layer: 26.16,26.29 29.72,26.29 29.72,23.58 26.16,23.58
GND on Top Layer: 67.31,72.77 64.13,72.77 64.13,71.63 67.31,71.63
GND on Top Layer: 66.93,9.78 71.37,9.78 71.37,12.57 71.37,12.57 66.8,12.57 66.04,11.81 66.04,10.67
GND on Top Layer: 19.49,12.71 19.49,14.01 20.3,14.82 21.92,14.82 21.92,12.7 19.5,12.7
GND on Top Layer: 65.63,15.59 61.62,15.59 61.59,15.62 61.59,16.76 62.87,18.03 64.13,18.03 65.66,16.51 65.66,15.62
GND on Top Layer: 10.29,40.89 10.29,38.82 13.72,38.82 13.72,40.89
GND on Top Layer: 56.21,75.47 56.13,75.39 56.13,74.38 60.19,74.38 60.19,74.69 60.07,74.8 57.89,74.8 57.22,75.47
GND on Top Layer: 18.57,54.52 21.94,54.52 21.94,56.4 18.57,56.4
GND on Top Layer: 38.77,72.88 38.77,69.78 40.58,69.78 40.58,72.89 38.78,72.89
GND on Top Layer: 71.37,38.35 71.37,41.15 67.44,41.15 67.44,38.33 71.35,38.33
GND on Top Layer: 76.92,53.21 76.92,56.28 81.86,56.28 81.86,53.21
GND on Top Layer: 22.25,87.47 21.96,87.18 21.96,83.87 22.4,83.87 22.48,83.95 22.48,85.47 22.61,85.6 23.27,85.6 23.5,85.82 23.5,87.38 23.4,87.47
GND on Top Layer: 26.16,55.88 29.72,55.88 29.72,53.09 26.16,53.09
GND on Top Layer: 14.87,12.33 11.81,12.33 11.81,10.32 14.86,10.32 14.87,10.32
GND on Top Layer: 63.25,3.05 66.67,3.05 66.67,1.15 66.68,1.14 63.25,1.14
GND on Top Layer: 13.72,47.37 13.72,44.45 17.59,44.45 17.59,47.38 13.72,47.38
GND on Top Layer: 62.75,62.12 63.88,63.25 67.06,63.25 67.44,63.63 67.44,65.02 67.06,65.41 63.12,65.41 61.59,63.88 57.43,63.88 57.43,62.12
GND on Top Layer: 74.54,59.96 78.98,59.96 78.98,58.43 78.97,58.42 74.55,58.42 74.54,58.43
GND on Top Layer: 18.92,24.81 21.98,24.81 21.98,26.82 18.92,26.82 18.92,26.81
GND on Top Layer: 27.74,81.15 27.74,77.98 30.84,77.98 30.84,79.1 31.61,79.87 33.59,79.87 33.59,81.08 33.66,81.15 27.74,81.15
GND on Top Layer: 25.78,3.94 29.59,3.94 29.59,1.24 25.81,1.24 25.78,1.27
GND on Top Layer: 19.3,76.71 19.43,76.58 20.32,76.58 20.45,76.71 20.45,79.49 20.44,79.5 19.3,79.5
GND on Top Layer: 55.88,55.75 55.88,53.21 59.44,53.21 59.44,55.75 59.43,55.75
GND on Top Layer: 55.88,32.77 55.88,30.1 59.44,30.1 59.44,32.76 59.43,32.77
GND on Top Layer: 18.16,17.91 18.16,16.38 11.47,16.38 11.47,17.86 11.43,17.91
GND on Top Layer: 63.12,84.84 63.12,78.96 65.86,78.96 65.86,81.97 64.64,83.19 64.64,84.84
GND on Top Layer: 67.31,76.71 63.88,76.71 63.88,75.53 67.28,75.53 67.31,75.56
GND on Top Layer: 62.87,31.12 66.88,31.12 66.88,29.03 62.85,29.03 62.85,31.1
GND on Top Layer: 23.01,85.6 22.65,85.96 22.65,87.47 24.68,87.47 24.68,86.52 23.75,85.6
GND on Top Layer: 55.88,27.18 55.88,24.51 59.44,24.51 59.44,27.18
GND on Top Layer: 7.49,4.32 7.49,1.34 2.92,1.34 2.92,4.32
GND on Top Layer: 23.24,78.87 23.24,75.18 24.51,75.18 24.51,78.87
GND on Top Layer: 2.97,32.65 7.37,32.65 7.39,32.66 7.39,29.2 7.39,29.2 2.98,29.2 2.97,29.2
GND on Top Layer: 19.29,41.13 22.23,41.13 22.23,43.01 22.19,43.05 19.3,43.05 19.29,43.04
GND on Top Layer: 19.81,14.35 20.83,15.37 22.34,15.37 22.34,12.7 21.21,12.7 19.81,14.1
GND on Top Layer: 54.96,74.3 54.9,74.35 54.9,75.64 54.99,75.73 57.12,75.73 58.3,74.55 59.53,74.55 59.28,74.3
GND on GND: 0.26,99.74 84.74,99.74 84.74,0.26 0.26,0.26
LEFT_1_AO1 on Top Layer: 19.18,76.33 19.18,78.23 17.4,78.23 15.24,76.07 15.24,72.14 15.75,71.63 17.32,71.63 17.65,71.97 17.65,75.69 18.29,76.33
LEFT_1_AO2 on Top Layer: 20.54,78.36 21.78,78.36 21.78,75.76 20.57,74.55 20.57,60.58 19.05,59.06 15.49,59.06 14.99,59.56 14.99,60.64 15.53,61.19 15.53,61.22 18.42,61.22 18.92,61.72 18.92,75.06 20.57,76.71 20.57,78.32
LEFT_2_BO1 on Top Layer: 25.91,78.36 24.63,78.36 24.63,74.27 24.27,73.91 23.24,73.91 23.03,73.7 23.03,71.71 23.24,71.5 25.15,71.5 25.91,72.26
LEFT_2_BO2 on Top Layer: 21.97,78.23 23.11,78.23 23.11,74.3 22.86,74.04 22.86,61.59 22.99,61.47 24.64,61.47 25.27,60.83 25.27,59.44 24.64,58.8 22.1,58.8 20.83,60.07 20.83,74.68 21.97,75.82
RIGHT_1_AO1 on Top Layer: 65.68,71.55 65.68,70.26 69.73,70.26 69.73,71.55
RIGHT_1_AO1 on Bottom Layer: 67.18,71.88 67.18,69.9 71.3,69.9 74.17,72.77 74.17,81.92 74.93,82.68 83.31,82.68 84.71,84.07 84.71,94.23 82.42,96.52 80.14,96.52 80.14,94.25 81.94,94.25 83,93.19 83,85.92 81.79,84.71 74.04,84.71 71.75,82.42 71.75,73.53 70.1,71.88
RIGHT_1_AO2 on Top Layer: 65.81,72.77 65.81,74.13 69.72,74.13 69.72,72.39 67.41,72.39 67.41,72.77
RIGHT_1_AO2 on Bottom Layer: 67.31,72.39 69.72,72.39 69.72,85 67.06,87.66 67.06,93.73 67.69,94.36 69.34,94.36 69.6,94.61 69.6,96.27 69.34,96.52 66.17,96.52 64.9,95.25 64.9,87 67.31,84.58
RIGHT_2_BO1 on Top Layer: 65.35,78.11 65.35,76.83 68.33,76.83 69.72,78.23 69.72,88.77 67.82,88.77 67.82,78.61 67.31,78.11
RIGHT_2_BO2 on Top Layer: 65.79,75.44 68.45,75.44 70.36,77.34 70.36,82.42 72.52,84.58 79.63,84.58 80.39,85.34 80.39,88.9 82.3,88.9 82.3,83.57 81.79,83.06 73.41,83.06 72.14,81.79 72.14,76.2 70.23,74.3 65.68,74.3 65.68,75.34
$2N1308 on Top Layer: 66.8,38.23 66.8,36.32 74.55,36.32 74.55,43.78 74.51,43.81 66.54,43.81 66.54,41.4 73.15,41.4 73.15,38.23
$2N1309 on Top Layer: 81.79,51.18 67.94,51.18 67.94,46.99 81.79,46.99
$2N1309 on Top Layer: 77.09,51.18 77.09,39.62 81.53,39.62 81.79,39.88 81.79,51.18
$2N1311 on Top Layer: 71.5,7.87 65.53,7.87 63.85,9.56 63.85,15.17 70.91,15.17 70.91,12.69 66.54,12.69 65.79,11.94 65.79,10.67 66.8,9.65 71.5,9.65
$2N1319 on Top Layer: 67.94,21.46 81.41,21.46 81.41,18.54 67.94,18.54
$2N1319 on Top Layer: 77.34,21.08 77.34,11.81 81.28,11.81 81.41,11.94 81.41,21.08
$2N1321 on Top Layer: 13.33,19.69 13.33,18.29 13.59,18.03 18.54,18.03 18.67,17.91 18.67,15.49 18.16,14.99 12.83,14.99 12.45,14.6 12.45,12.7 18.92,12.7 19.05,12.83 19.05,14.1 20.07,15.11 20.07,18.54 18.92,19.69
$2N1328 on Top Layer: 3.43,9.27 17.53,9.27 17.53,6.23 3.55,6.23 3.43,6.35
$2N1328 on Top Layer: 3.43,6.26 6.98,6.26 6.98,17.29 6.58,16.89 3.43,16.89
$2N1328 on Top Layer: 6.1,12.32 9.14,15.37 6.98,15.37 5.97,16.38 5.97,12.45
$2N1328 on Top Layer: 9.91,19.94 11.81,19.94 10.18,18.31 9.63,18.31 9.63,19.66
$2N1328 on Top Layer: 2.16,15.49 3.81,13.84 3.81,16.26 4.44,16.89 3.56,16.89
$2N1328 on Top Layer: 6.86,11.3 9.14,9.02 6.85,9.02 6.85,11.29
$2N1328 on Top Layer: 18.54,21.34 18.54,19.81 9.15,19.81 9.14,19.81 9.14,21.21 9.27,21.34
$2N1328 on Top Layer: 10.16,22.61 11.94,20.83 9.14,20.83 9.14,21.59
$2N1329 on Top Layer: 42.5,2.57 49.89,2.57 49.9,2.58 49.9,17.48 47.59,19.78 44.79,19.78 42.5,17.49
$2N2945 on Top Layer: 6.6,39.12 7.37,38.35 17.78,38.35 17.78,34.99 3.88,34.99 3.68,35.18 3.68,38.99 3.81,39.12
$2N2945 on Top Layer: 3.71,35.12 3.71,43.18 1.78,45.11 1.78,45.47 8.64,45.47 8.76,45.34 6.6,43.18 6.6,35.05 3.77,35.05
$2N2946 on Top Layer: 12.95,47.03 13.44,47.62 17.78,47.62 17.78,49.4 10.54,49.4 10.54,41.28 18.95,41.28 18.95,44.07 12.95,44.07

Small or netless copper shapes (teardrops, artwork), in the pictures only: 153 on Top Layer, 28 on Bottom Layer

## Text on the board
Top Silkscreen Layer: G | V | S | 3 | 5
